# Altium schematic sheet ARM_USB_TO_RS232.SchDoc
size A4; PageSetup: Record=PageOptions|CenterHorizontal=True|CenterVertical=True|PrintScale=0.97|XCorrection=1.00|YCorrection=1.00|PrintKind=0|BorderSize=5000000|LeftOffset=0|BottomOffset=0|Orientation=2|PaperLength=1000|PaperWidth=1000|Scale=100|PaperSource=7|PrintQuality=-3|MediaType=1|DitherType=10|PrintScaleMode=1|PaperKind=A4|PaperIndex=9
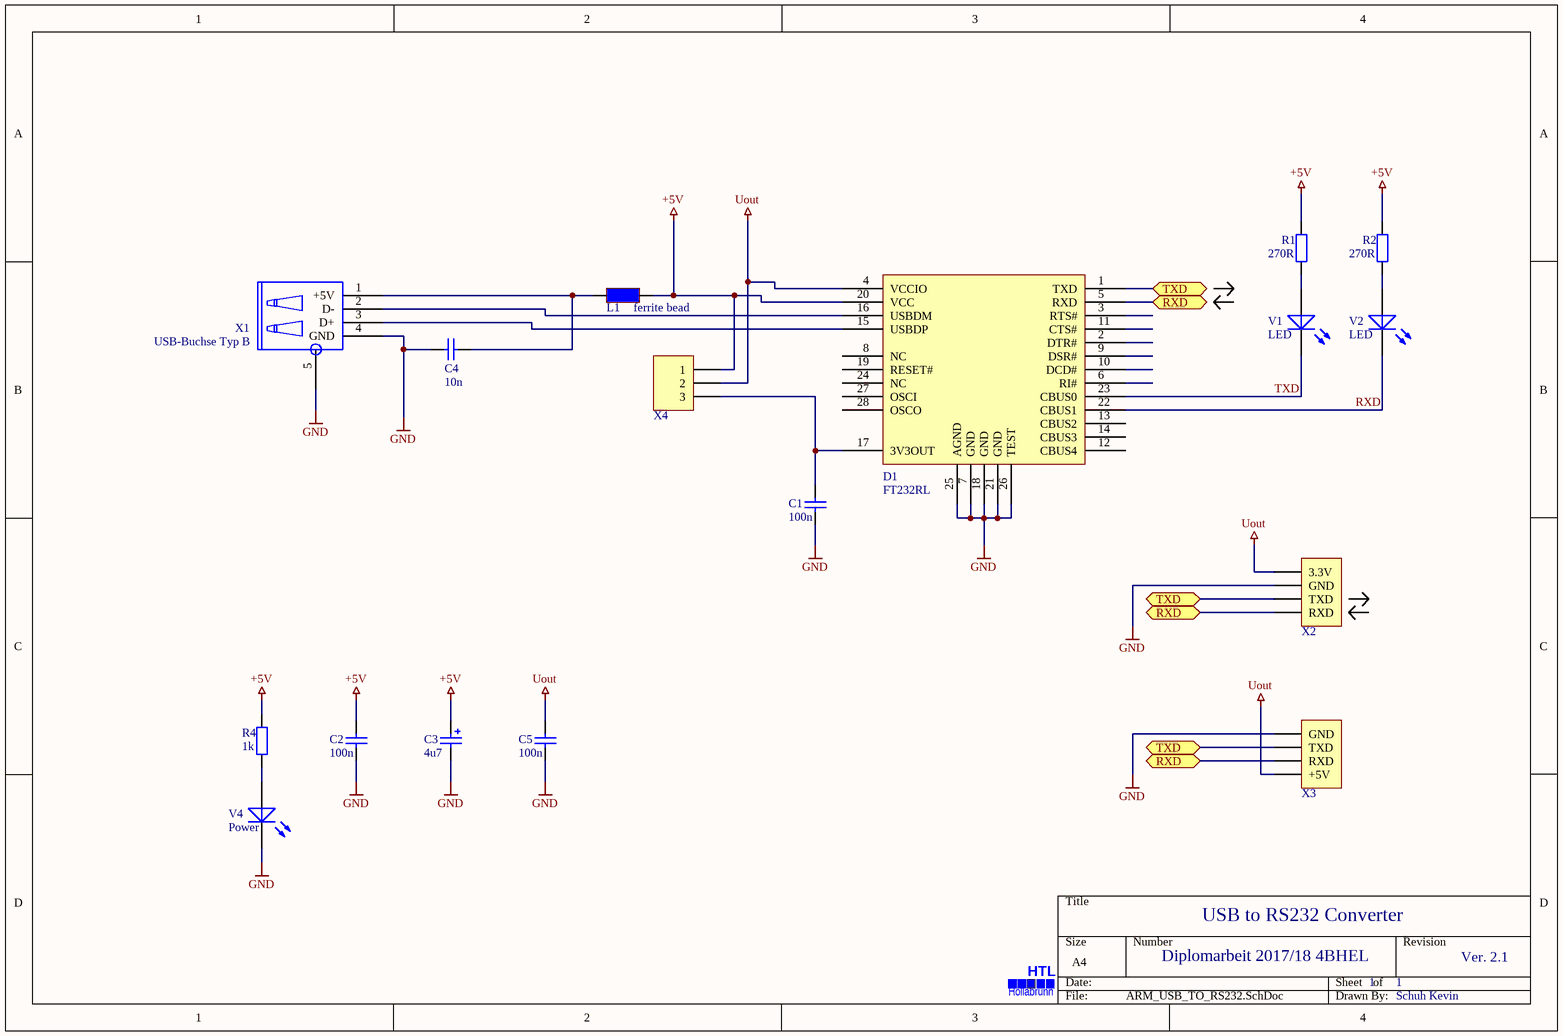
[diagram p0: ARM_USB_TO_RS232.SchDoc]

## Parts
C1  value 100n  [0805_CAP]  (hidden comment: Cap_Keramik_SMD)
C2  value 100n  [0805_CAP]  (hidden comment: Cap_Keramik_SMD)
C3  value 4u7  [1411_Cap_Pol]  (hidden comment: Cap_Pol)
C4  value 10n  [0805_CAP]  (hidden comment: Cap_Keramik_SMD)
C5  value 100n  [0805_CAP]  (hidden comment: Cap_Keramik_SMD)
D1  FT232RL  [SSOP_28]
L1  ferrite bead  [0805_ferrit]
Logo  HTL Hollabrunn  [HTL_Logo]  (value not drawn)
R1  value 270R  [0805_Res]  (hidden comment: Res_SMD)
R2  value 270R  [0805_Res]  (hidden comment: Res_SMD)
R4  value 1k  [0805_Res]  (hidden comment: Res_SMD)
V1  LED  [0805_LED]
V2  LED  [0805_LED]
V4  Power  [0805_LED]
X1  USB-Buchse Typ B  [USB_Buchse_Typ_B]
X2  UART1  [HDR1X4]  (value not drawn)
X3  Nextion  [NEXTION]  (value not drawn)
X4  Header_3  [HDR1X3]  (value not drawn)

## Ports
RXD, TXD

## Nets
+5V: C2.1 C3.1 D1.20(VCC) L1.2 R1.2 R2.2 R4.2 X4.1
GND: C1.2 C2.2 C3.2 C4.1 C5.2 D1.7(GND) D1.18(GND) D1.21(GND) D1.25(AGND) D1.26(TEST) V4.2(K) X1.4(GND) X1.5(GND) X2.2(GND) X3.1(GND)
Uout: C5.1 D1.4(VCCIO) X2.1(3.3V) X3.4(+5V) X4.2
RXD: D1.5(RXD) X2.4(RXD) X3.3(RXD) ; port RXD
RXD: D1.22(CBUS1) V2.2(K)  [a separate net that carries the same name]
TXD: D1.1(TXD) X2.3(TXD) X3.2(TXD) ; port TXD
TXD: D1.23(CBUS0) V1.2(K)  [a separate net that carries the same name]
NetC1_1: C1.1 D1.17(3V3OUT) X4.3
NetC4_2: C4.2 L1.1 X1.1(+5V)
NetD1_15: D1.15(USBDP) X1.3(D+)
NetD1_16: D1.16(USBDM) X1.2(D-)
NetR1_1: R1.1 V1.1(A)
NetR2_1: R2.1 V2.1(A)
NetR4_1: R4.1 V4.1(A)

Not connected (* = marked no-connect by the designer): D1 2(DTR#) 3(RTS#) 6(RI#) 8(NC) 9(DSR#) 10(DCD#) 11(CTS#) 12(CBUS4) 13(CBUS2) 14(CBUS3) 19(RESET#) 24(NC) 27(OSCI) 28(OSCO)

## Notes on the sheet
- USB to RS232 Converter
- Diplomarbeit 2017/18 4BHEL
- 1
- Ver. 2.1
- Schuh Kevin
- (in symbol HTL Logo) HTL; Hollabrunn

## Library data of the parts
C1 C2 C4 C5 = Cap_Keramik_SMD: Capacitor_SMD; Published: 8-Jun-2000; LatestRevisionDate: 17-Jul-2002; LatestRevisionNote: Re-released for DXP Platform.; PackageReference: RAD-0.3; Publisher: Altium Limited
C3 = Cap_Pol: Polarized Capacitor; Published: 8-Jun-2000; LatestRevisionDate: 17-Jul-2002; LatestRevisionNote: Re-released for DXP Platform.; PackageReference: RB7.6-15; Publisher: Altium Limited
L1 = Inductor: Code_IEC: 1005; Value: 10mH; Published: 8-Jun-2000; LatestRevisionDate: 17-Jul-2002; LatestRevisionNote: Re-released for DXP Platform.; PackageReference: 0402-A; Publisher: Altium Limited; Code_JEITA: 0402
Logo = HTL Logo
R1 R2 R4 = Res_SMD: Resistor; Published: 8-Jun-2000; LatestRevisionDate: 17-Jul-2002; LatestRevisionNote: Re-released for DXP Platform.; PackageReference: AXIAL-0.4; Publisher: Altium Limited
V1 V2 V4 = LED: Typical RED, GREEN, YELLOW, AMBER GaAs LED; Published: 8-Jun-2000; LatestRevisionDate: 17-Jul-2002; LatestRevisionNote: Re-released for DXP Platform.; PackageDocument: Feb-2002; PackageReference: 3.2X1.6X1.1; Publisher: Altium Limited
X1 = USB_Buchse_Typ_B: USB Buchse (A)
X2 = UART1: Header, 4-Pin; LatestRevisionDate: 17-Jul-2002; LatestRevisionNote: Re-released for DXP Platform.; Publisher: Altium Limited
X3 = Nextion: Header, 4-Pin; LatestRevisionDate: 17-Jul-2002; LatestRevisionNote: Re-released for DXP Platform.; Publisher: Altium Limited
X4 = Header_3: Header, 3-Pin; LatestRevisionDate: 17-Jul-2002; LatestRevisionNote: Re-released for DXP Platform.; Publisher: Altium Limited